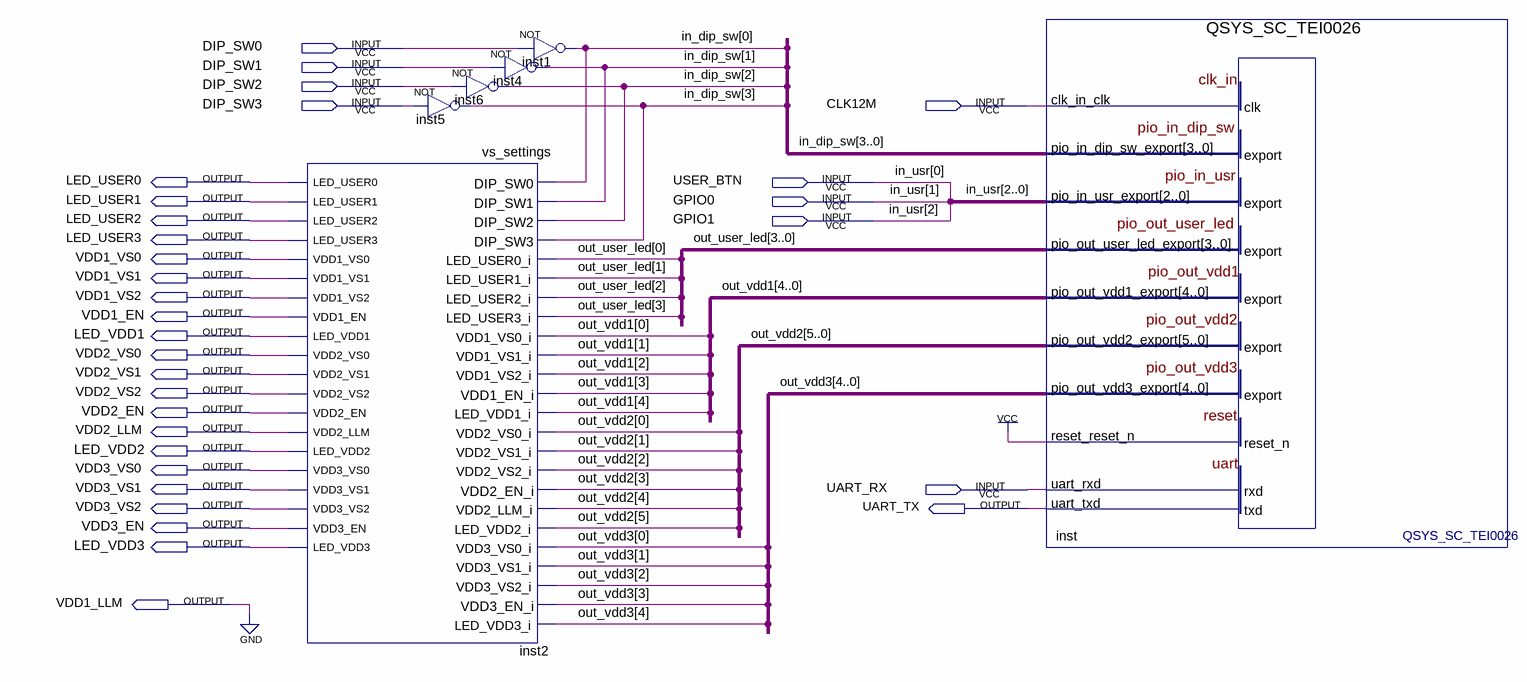
[diagram p0: schematic sheet]
// Quartus schematic TEI0026.bdf as structural Verilog: 6 symbols, 31 pins
module TEI0026 (
  input  DIP_SW0,
  input  DIP_SW1,
  input  DIP_SW2,
  input  DIP_SW3,
  input  CLK12M,
  input  USER_BTN,
  input  GPIO0,
  input  GPIO1,
  input  UART_RX,
  output LED_USER0,
  output LED_USER1,
  output LED_USER2,
  output LED_USER3,
  output VDD1_VS0,
  output VDD1_VS1,
  output VDD1_VS2,
  output VDD1_EN,
  output LED_VDD1,
  output VDD2_VS0,
  output VDD2_VS1,
  output VDD2_VS2,
  output VDD2_EN,
  output VDD2_LLM,
  output LED_VDD2,
  output VDD3_VS0,
  output VDD3_VS1,
  output VDD3_VS2,
  output UART_TX,
  output VDD3_EN,
  output LED_VDD3,
  output VDD1_LLM
);

  wire [3:0] in_dip_sw, out_user_led;
  wire [4:0] out_vdd1, out_vdd3;
  wire [5:0] out_vdd2;

  vs_settings inst2 (
    .DIP_SW0(in_dip_sw[0]), .DIP_SW1(in_dip_sw[1]), .DIP_SW2(in_dip_sw[2]), .DIP_SW3(in_dip_sw[3]),
    .LED_USER0_i(out_user_led[0]), .LED_USER1_i(out_user_led[1]), .LED_USER2_i(out_user_led[2]),
    .LED_USER3_i(out_user_led[3]), .VDD1_VS0_i(out_vdd1[0]), .VDD1_VS1_i(out_vdd1[1]),
    .VDD1_VS2_i(out_vdd1[2]), .VDD1_EN_i(out_vdd1[3]), .LED_VDD1_i(out_vdd1[4]), .VDD2_VS0_i(out_vdd2[0]),
    .VDD2_VS1_i(out_vdd2[1]), .VDD2_VS2_i(out_vdd2[2]), .VDD2_EN_i(out_vdd2[3]), .VDD2_LLM_i(out_vdd2[4]),
    .LED_VDD2_i(out_vdd2[5]), .VDD3_VS0_i(out_vdd3[0]), .VDD3_VS1_i(out_vdd3[1]), .VDD3_VS2_i(out_vdd3[2]),
    .VDD3_EN_i(out_vdd3[3]), .LED_VDD3_i(out_vdd3[4]), .LED_USER0(LED_USER0), .LED_USER1(LED_USER1),
    .LED_USER2(LED_USER2), .LED_USER3(LED_USER3), .VDD1_VS0(VDD1_VS0), .VDD1_VS1(VDD1_VS1),
    .VDD1_VS2(VDD1_VS2), .VDD1_EN(VDD1_EN), .LED_VDD1(LED_VDD1), .VDD2_VS0(VDD2_VS0), .VDD2_VS1(VDD2_VS1),
    .VDD2_VS2(VDD2_VS2), .VDD2_EN(VDD2_EN), .VDD2_LLM(VDD2_LLM), .LED_VDD2(LED_VDD2), .VDD3_VS0(VDD3_VS0),
    .VDD3_VS1(VDD3_VS1), .VDD3_VS2(VDD3_VS2), .VDD3_EN(VDD3_EN), .LED_VDD3(LED_VDD3));
  not inst6 (in_dip_sw[2], DIP_SW2);
  not inst5 (in_dip_sw[3], DIP_SW3);
  not inst1 (in_dip_sw[0], DIP_SW0);
  not inst4 (in_dip_sw[1], DIP_SW1);
  QSYS_SC_TEI0026 inst (
    .clk_in_clk(CLK12M), .pio_in_dip_sw_export(in_dip_sw), .pio_in_usr_export({GPIO1, GPIO0, USER_BTN}),
    .reset_reset_n(1'b1), .uart_rxd(UART_RX), .pio_out_user_led_export(out_user_led),
    .pio_out_vdd1_export(out_vdd1), .pio_out_vdd2_export(out_vdd2), .pio_out_vdd3_export(out_vdd3),
    .uart_txd(UART_TX));

  assign VDD1_LLM = 1'b0;

  // Other names for the same wires on the sheet: in_usr[2:0] = {GPIO1, GPIO0, USER_BTN}
endmodule
